# Altium schematic sheet purepath.SchDoc
size A4
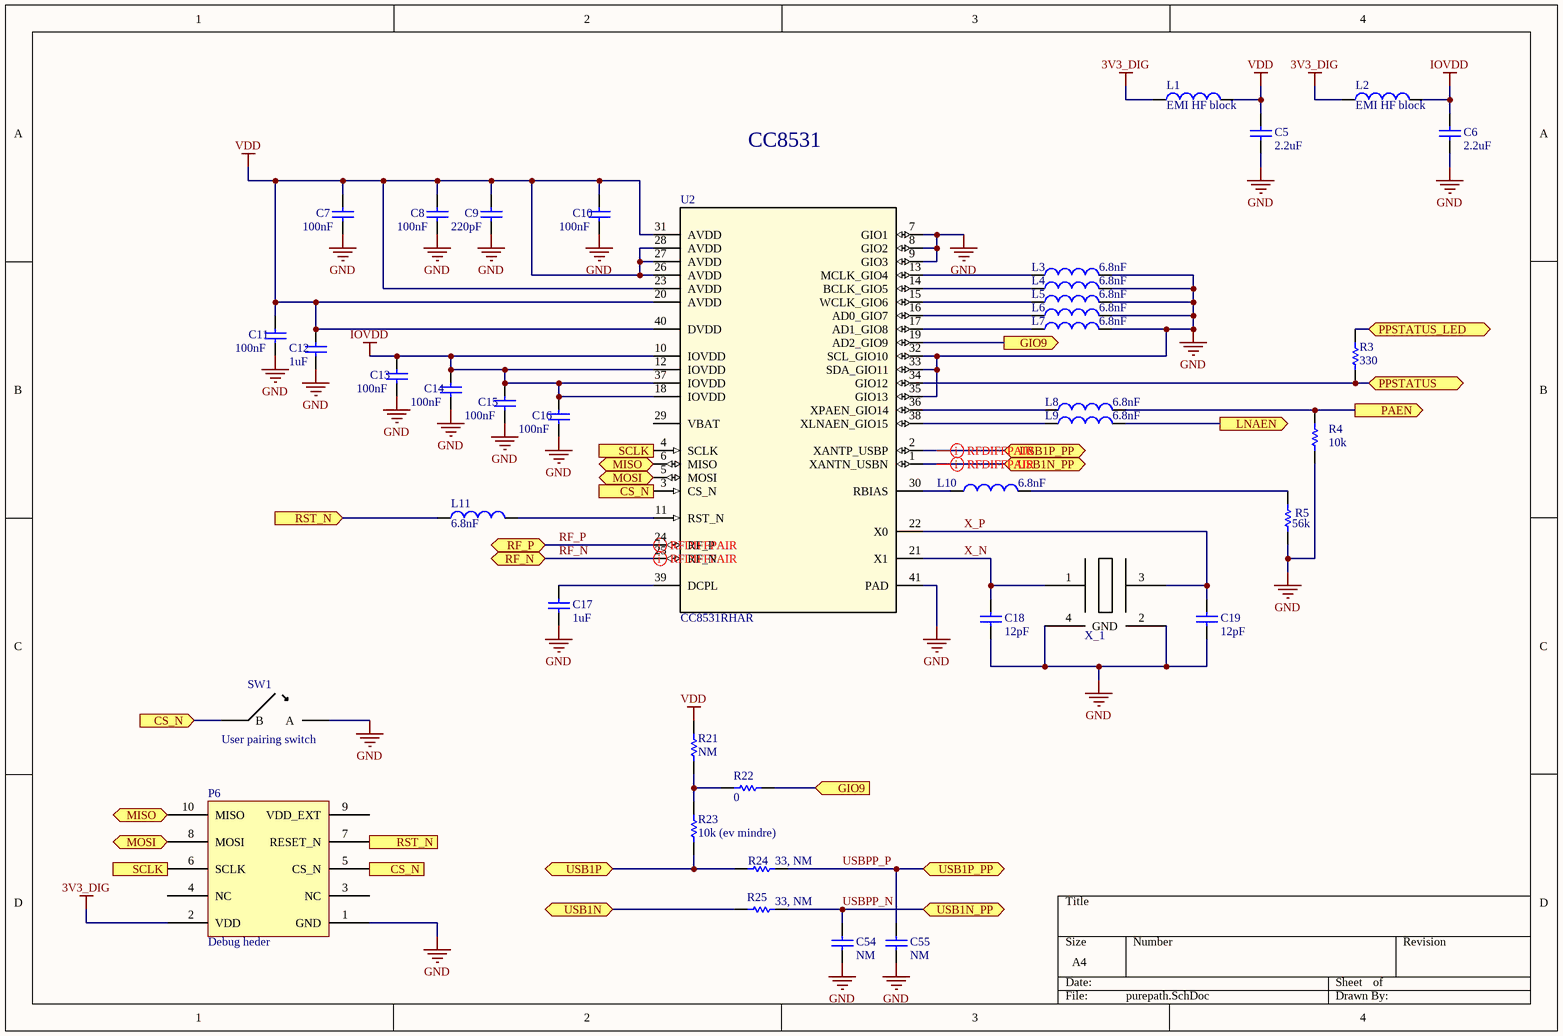
[diagram p0: purepath.SchDoc]

## Parts
C5  value 2.2uF  [C_0402]
C6  value 2.2uF  [C_0402]
C7  value 100nF  [C_0402]
C8  value 100nF  [C_0402]
C9  value 220pF  [C_0402]
C10  value 100nF  [C_0402]
C11  value 100nF  [C_0402]
C12  value 1uF  [C_0402]
C13  value 100nF  [C_0402]
C14  value 100nF  [C_0402]
C15  value 100nF  [C_0402]
C16  value 100nF  [C_0402]
C17  value 1uF  [C_0402]
C18  value 12pF  [C_0402]
C19  value 12pF  [C_0402]
C54  value NM  [C_0402]
C55  value NM  [C_0402]
L1  value EMI HF block  [L_0402]  (hidden comment: Inductor)
L2  value EMI HF block  [L_0402]  (hidden comment: Inductor)
L3  value 6.8nF  [L_0402]  (hidden comment: Inductor)
L4  value 6.8nF  [L_0402]  (hidden comment: Inductor)
L5  value 6.8nF  [L_0402]  (hidden comment: Inductor)
L6  value 6.8nF  [L_0402]  (hidden comment: Inductor)
L7  value 6.8nF  [L_0402]  (hidden comment: Inductor)
L8  value 6.8nF  [L_0402]  (hidden comment: Inductor)
L9  value 6.8nF  [L_0402]  (hidden comment: Inductor)
L10  value 6.8nF  [L_0402]  (hidden comment: Inductor)
L11  value 6.8nF  [L_0402]  (hidden comment: Inductor)
P6  Debug heder  [2x5 1.27mm header]
R3  Res1  [R_0402]  (value not drawn)
R4  value 10k  [R_0402]  (hidden comment: Res1)
R5  value 56k  [R_0402]  (hidden comment: Res1)
R21  value NM  [R_0402]  (hidden comment: Res1)
R22  value 0  [R_0402]  (hidden comment: Res1)
R23  value 10k (ev mindre)  [R_0402]  (hidden comment: Res1)
R24  value 33, NM  [R_0402]  (hidden comment: Res1)
R25  value 33, NM  [R_0402]  (hidden comment: Res1)
SW1  User pairing switch  [edge swich]
U2  CC8531RHAR  [RHA0040H]
X_1  X_48  [48Mhz 2x1.6mm SMD]  (value not drawn)

## Ports
CS_N (in), GIO9 (in), GIO9 (out), LNAEN (out), MISO (bidir), MOSI (bidir), PAEN (out), PPSTATUS (bidir), PPSTATUS_LED (bidir), RF_N (bidir), RF_P (bidir), RST_N (in), SCLK (in), SCLK (out), USB1N (bidir), USB1N_PP (bidir), USB1P (bidir), USB1P_PP (bidir)

## Nets
3V3_DIG: L1.1 L2.1 P6.2(VDD)
GND: C5.1 C6.1 C7.1 C8.1 C9.1 C10.1 C11.1 C12.1 C13.2 C14.2 C15.2 C16.2 C17.1 C18.1 C19.1 C54.1 C55.1 L3.2 L4.2 L5.2 L6.2 L7.2 P6.1(GND) R4.1 R5.1 SW1.A U2.7(GIO1) U2.8(GIO2) U2.9(GIO3) U2.32(SCL_GIO10) U2.33(SDA_GIO11) U2.35(GIO13) U2.41(PAD) X_1.2(GND) X_1.4(GND)
IOVDD: C6.2 C13.1 C14.1 C15.1 C16.1 L2.2 U2.10(IOVDD) U2.12(IOVDD) U2.18(IOVDD) U2.37(IOVDD)
VDD: C5.2 C7.2 C8.2 C9.2 C10.2 C11.2 C12.2 L1.2 R21.2 U2.20(AVDD) U2.23(AVDD) U2.26(AVDD) U2.27(AVDD) U2.28(AVDD) U2.31(AVDD) U2.40(DVDD)
CS_N: P6.5(CS_N) SW1.B U2.3(CS_N) ; port CS_N
GIO9: R22.1 U2.19(AD2_GIO9) ; port GIO9
LNAEN: L9.2 ; port LNAEN
MISO: P6.10(MISO) U2.6(MISO) ; port MISO
MOSI: P6.8(MOSI) U2.5(MOSI) ; port MOSI
PAEN: L8.2 R4.2 ; port PAEN
PPSTATUS: R3.1 U2.34(GIO12) ; port PPSTATUS
PPSTATUS_LED: R3.2 ; port PPSTATUS_LED
RF_N: U2.25(RF_N) ; port RF_N
RF_P: U2.24(RF_P) ; port RF_P
RST_N: L11.1 P6.7(RESET_N) ; port RST_N
SCLK: P6.6(SCLK) U2.4(SCLK) ; port SCLK
USB1N: R25.2 ; port USB1N
USB1P: R23.1 R24.2 ; port USB1P
USBPP_N: C54.2 R25.1 U2.1(XANTN_USBN) ; port USB1N_PP
USBPP_P: C55.2 R24.1 U2.2(XANTP_USBP) ; port USB1P_PP
X_N: C18.2 U2.21(X1) X_1.1
X_P: C19.2 U2.22(X0) X_1.3
NetC17_2: C17.2 U2.39(DCPL)
NetL3_1: L3.1 U2.13(MCLK_GIO4)
NetL4_1: L4.1 U2.14(BCLK_GIO5)
NetL5_1: L5.1 U2.15(WCLK_GIO6)
NetL6_1: L6.1 U2.16(AD0_GIO7)
NetL7_1: L7.1 U2.17(AD1_GIO8)
NetL8_1: L8.1 U2.36(XPAEN_GIO14)
NetL9_1: L9.1 U2.38(XLNAEN_GIO15)
NetL10_1: L10.1 U2.30(RBIAS)
NetL10_2: L10.2 R5.2
NetL11_2: L11.2 U2.11(RST_N)
NetR21_1: R21.1 R22.2 R23.2

Not connected (* = marked no-connect by the designer): P6 3(NC) 4(NC) 9(VDD_EXT); U2 29(VBAT)

## Layout directives
differential pair: RF_N, RF_P, USBPP_N, USBPP_P

## Notes on the sheet
- CC8531
- (in symbol Res1) 330

## Library data of the parts
C5-C19 C54 C55 = Cap
P6 = debug
R3-R5 R21-R25 = Res1: Resistor
SW1 = edge switch
U2 = CC8531RHAR: Imported; Manufacturer: Texas Instruments; PartNumber: CC8531RHAR; RefDes: RefDes; TYPE: TYPE; Value: Value